# Altium project Optic_sensor_quad.PrjPcb
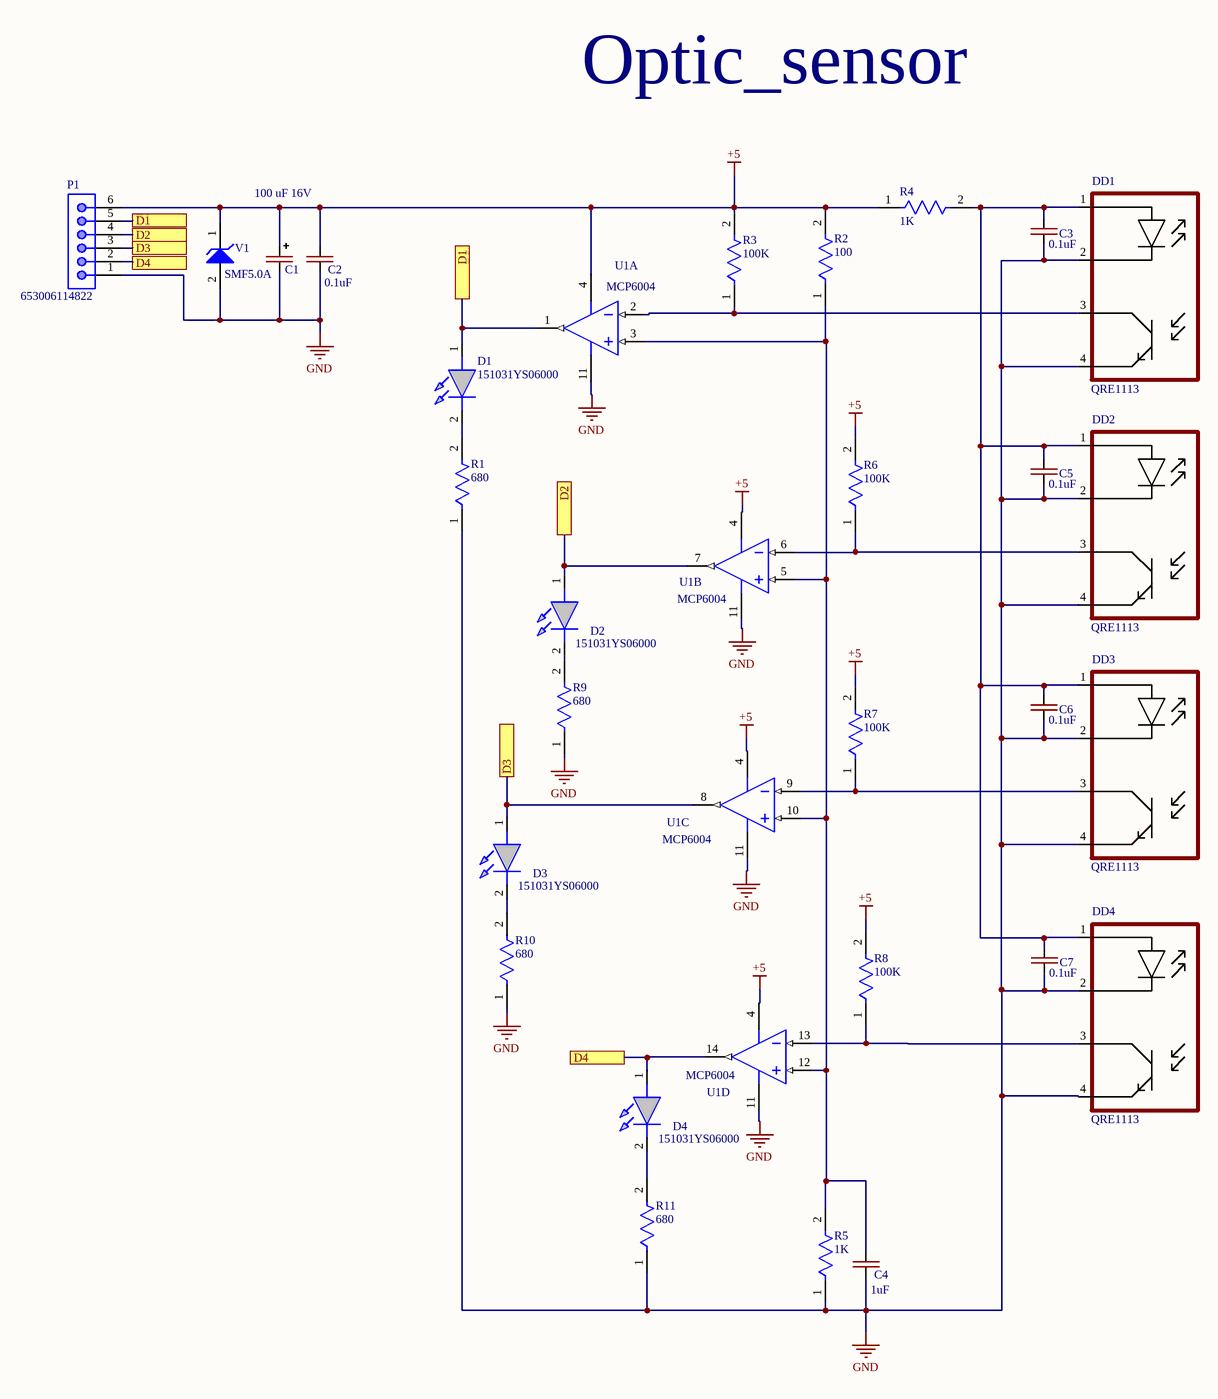
[diagram p0: Optic_sensor_quad.SchDoc]
1 sheet, 29 parts. Net scope: flat (ports and power ports of the same name join across sheets).
Board file: Optic_sensor_quad.PcbDoc

## Sheet Optic_sensor_quad.SchDoc
size A3; SheetNumber: 1; SheetTotal: 1

### Parts
C1  100 uF 16V  [CAP-TAN-C]
C2  0.1uF  [CAP-0603]
C3  0.1uF  [CAP-0603]
C4  1uF  [CAP-0603]
C5  0.1uF  [CAP-0603]
C6  0.1uF  [CAP-0603]
C7  0.1uF  [CAP-0603]
D1  151031YS06000  [LED_GREEN]
D2  151031YS06000  [LED_GREEN]
D3  151031YS06000  [LED_GREEN]
D4  151031YS06000  [LED_GREEN]
DD1  QRE1113  [QRE1113]
DD2  QRE1113  [QRE1113]
DD3  QRE1113  [QRE1113]
DD4  QRE1113  [QRE1113]
P1  653006114822  [653006114822]
R1  680  [RES-0603]
R2  100  [RES-0603]
R3  100K  [RES-0603]
R4  1K  [RES-0603]
R5  1K  [RES-0603]
R6  100K  [RES-0603]
R7  100K  [RES-0603]
R8  100K  [RES-0603]
R9  680  [RES-0603]
R10  680  [RES-0603]
R11  680  [RES-0603]
U1  MCP6004  [TSSOP-ST14_L]  (parts A,B,C,D of 4)
V1  SMF5.0A  [SOD-123]

### Ports
D1, D2, D3, D4

### Nets
+5: C1.1(+) C2.2 P1.6 R2.2 R3.2 R4.1 R6.2 R7.2 R8.2 U1.4(VDD) V1.1(K)
GND: C1.2(-) C2.1 C3.1 C4.1 C5.1 C6.1 C7.1 DD1.2(CATHODE) DD1.4 DD2.2(CATHODE) DD2.4 DD3.2(CATHODE) DD3.4 DD4.2(CATHODE) DD4.4 P1.1 R1.1 R5.1 R9.1 R10.1 R11.1 U1.11(VSS) V1.2(A)
NetC3_2: C3.2 C5.2 C6.2 C7.2 DD1.1(ANODE) DD2.1(ANODE) DD3.1(ANODE) DD4.1(ANODE) R4.2
NetC4_2: C4.2 R2.1 R5.2 U1.3(VINA+) U1.5(VINB+) U1.10(VINC+) U1.12(VIND+)
NetD1_1: D1.1(A) P1.5 U1.1(VOUTA) ; port D1
NetD1_2: D1.2(K) R1.2
NetD2_1: D2.1(A) P1.4 U1.7(VOUTB) ; port D2
NetD2_2: D2.2(K) R9.2
NetD3_1: D3.1(A) P1.3 U1.8(VOUTC) ; port D3
NetD3_2: D3.2(K) R10.2
NetD4_1: D4.1(A) P1.2 U1.14(VOUTD) ; port D4
NetD4_2: D4.2(K) R11.2
NetDD1_3: DD1.3 R3.1 U1.2(VINA-)
NetDD2_3: DD2.3 R6.1 U1.6(VINB-)
NetDD3_3: DD3.3 R7.1 U1.9(VINC-)
NetDD4_3: DD4.3 R8.1 U1.13(VIND-)

### Notes on the sheet
- Optic_sensor

### Library data of the parts
C1 = CAP-POLAR: 25 uF 16V
C2-C7 = CAP-NON-POLAR
D1-D4 = LED: WURTH ELEKTRONIK - 151031YS06000 - LED, Yellow, Through Hole, T-1 (3mm), 30 mA, 2 V, 590 nm; Geometry.Height: 5.5mm; Manufacturer_Name: Wurth Elektronik; Manufacturer_Part_Number: 151031YS06000; Mouser Part Number: 710-151031YS06000; Mouser Price/Stock: https://www.mouser.co.uk/ProductDetail/Wurth-Elektronik/151031YS06000?qs=LlUlMxKIyB3xSYYW%252BcuBiQ%3D%3D; Arrow Part Number: *; Arrow Price/Stock: *; Mouser Testing Part Number: *; Mouser Testing Price/Stock: *; Datasheet Link: https://katalog.we-online.de/led/datasheet/151031YS06000.pdf
P1 = 653006114822: WR-WTB THT Male Vertical Shrouded Header, pitch 1.25mm, 6p; Pin Number: 6; Contact Resistance: 20mOhm; Rated Current: 1A; Withstanding Voltage: 250VAC; Working Voltage: 125VAC; ComponentLink1Description: Manufacturer; ComponentLink1URL: http://www.we-online.de; ComponentLink2Description: Datasheet; ComponentLink2URL: https://www.we-online.com/catalog/datasheet/653006114822.pdf; Pitch: 1.25mm; Published Date: January 2020; Publisher: Wurth Elektronik; Mounting Technology: THT; Packaging: Tube; Operating Temperature: -40 to +85degC; Part Number: 653006114822; Gender: Male; Type: Vertical
R1-R11 = RES-CONST
U1 = MCP6004: MCP6004 TSSOP
V1 = SMF5.0A: SMF5.0A SOD-123